# Altium project MSE-Avionic-N1.PrjPcb (part 2 of 2)

## Sheet GPIOSheet.SchDoc
size A; SheetNumber: 4; SheetTotal: 4
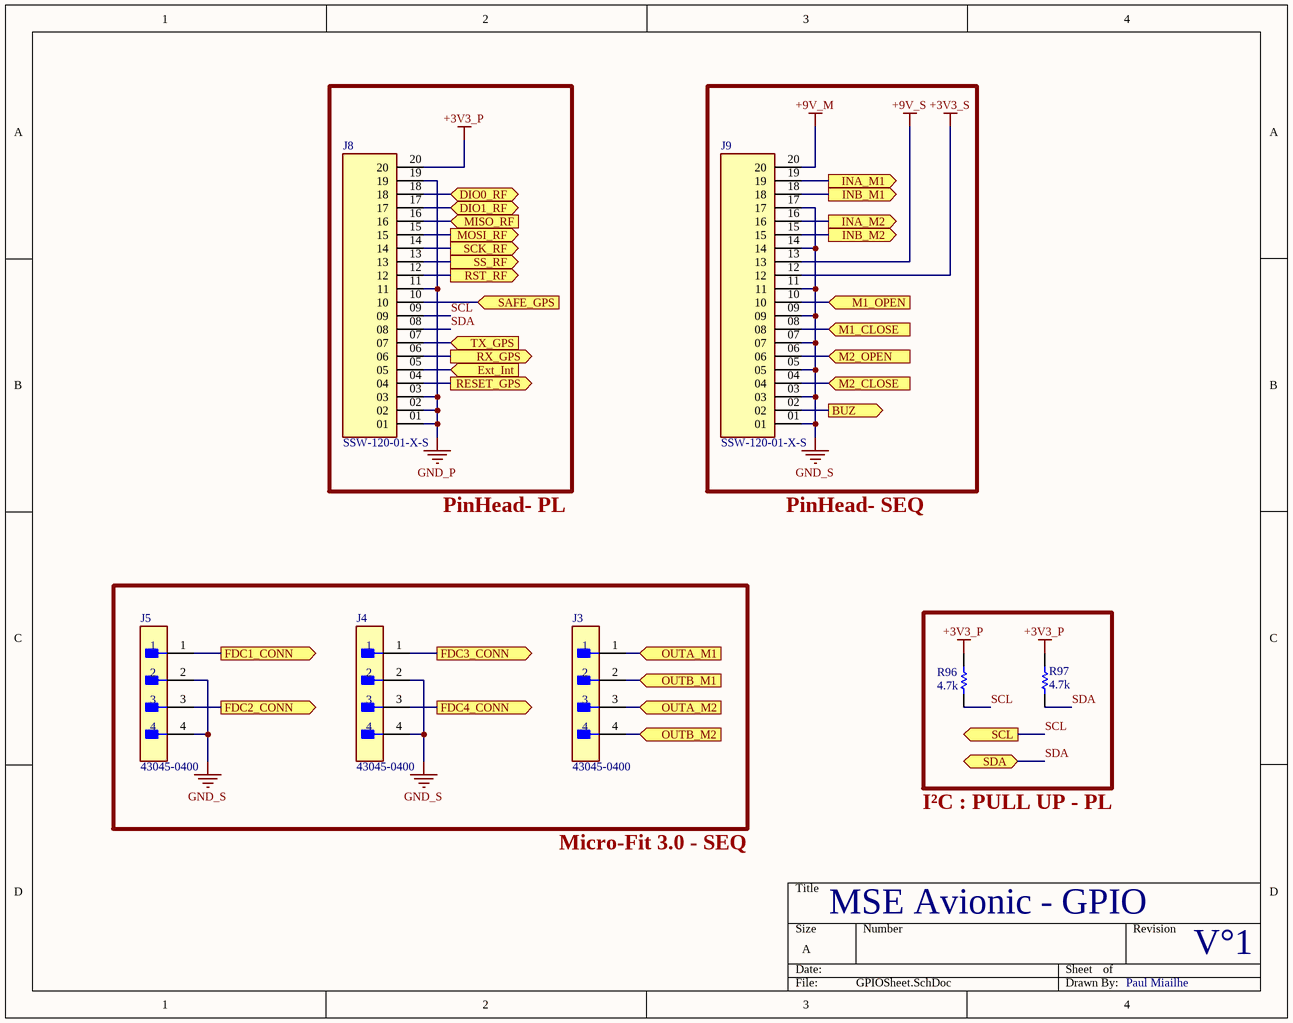
[diagram p3: GPIOSheet.SchDoc]

### Parts
J3  43045-0400  [FP-43045-0400-MFG]
J4  43045-0400  [FP-43045-0400-MFG]
J5  43045-0400  [FP-43045-0400-MFG]
J8  SSW-120-01-X-S  [SAMTEC_SSW-120-01-X-S]
J9  SSW-120-01-X-S  [SAMTEC_SSW-120-01-X-S]
R96  Resistance: 4.7k  [RESC1608X55X25LL10T15]  (hidden comment: RC0603FR-074K7L)
R97  Resistance: 4.7k  [RESC1608X55X25LL10T15]  (hidden comment: RC0603FR-074K7L)

### Ports
BUZ (out), DIO0_RF (bidir), DIO1_RF (bidir), Ext_Int (in), FDC1_CONN (out), FDC2_CONN (out), FDC3_CONN (out), FDC4_CONN (out), INA_M1 (out), INA_M2 (out), INB_M1 (out), INB_M2 (out), M1_CLOSE (in), M1_OPEN (in), M2_CLOSE (in), M2_OPEN (in), MISO_RF (in), MOSI_RF (out), OUTA_M1 (in), OUTA_M2 (in), OUTB_M1 (in), OUTB_M2 (in), RESET_GPS (out), RST_RF (out), RX_GPS (out), SAFE_GPS (in), SCK_RF (out), SCL (out), SDA (bidir), SS_RF (out), TX_GPS (in)

### Nets
+3V3_P: J8.20 R96.2 R97.2
+3V3_S: J9.12
+9V_M: J9.20
+9V_S: J9.13
GND_P: J8.01 J8.02 J8.03 J8.11 J8.19
GND_S: J4.2 J4.4 J5.2 J5.4 J9.01 J9.03 J9.05 J9.07 J9.09 J9.11 J9.14 J9.17
M1_CLOSE: J9.08 ; port M1_CLOSE
M1_OPEN: J9.10 ; port M1_OPEN
M2_CLOSE: J9.04 ; port M2_CLOSE
M2_OPEN: J9.06 ; port M2_OPEN
OUTA_M1: J3.1 ; port OUTA_M1
OUTA_M2: J3.3 ; port OUTA_M2
OUTB_M1: J3.2 ; port OUTB_M1
OUTB_M2: J3.4 ; port OUTB_M2
SCL: J8.09 R96.1 ; port SCL
SDA: J8.08 R97.1 ; port SDA
NetC7_2: J5.1 ; port FDC1_CONN
NetC8_2: J5.3 ; port FDC2_CONN
NetC9_2: J4.1 ; port FDC3_CONN
NetC10_2: J4.3 ; port FDC4_CONN
NetJ8_04: J8.04 ; port RESET_GPS
NetJ8_05: J8.05 ; port Ext_Int
NetJ8_06: J8.06 ; port RX_GPS
NetJ8_07: J8.07 ; port TX_GPS
NetJ8_10: J8.10 ; port SAFE_GPS
NetJ8_12: J8.12 ; port RST_RF
NetJ8_13: J8.13 ; port SS_RF
NetJ8_14: J8.14 ; port SCK_RF
NetJ8_15: J8.15 ; port MOSI_RF
NetJ8_16: J8.16 ; port MISO_RF
NetJ8_17: J8.17 ; port DIO1_RF
NetJ8_18: J8.18 ; port DIO0_RF
NetJ9_02: J9.02 ; port BUZ
NetJ9_15: J9.15 ; port INB_M2
NetJ9_16: J9.16 ; port INA_M2
NetJ9_18: J9.18 ; port INB_M1
NetJ9_19: J9.19 ; port INA_M1

### Notes on the sheet
- PinHead- PL
- PinHead- SEQ
- Micro-Fit 3.0 - SEQ
- I²C : PULL UP - PL
- MSE Avionic - GPIO
- V°1
- Paul Miailhe

### Library data of the parts
J3-J5 = CMP-04776-000002-1: CONN HEADER R/A 4POS 3MM; Manufacturer: Molex; Conn Gender: Male; Conn Orientation: Right Angle; Voltage Rating: 600V; Number Of Contacts: 4; Is Female: yes; Current Rating: 8.5A; ComponentLink2URL: https://www.molex.com/webdocs/datasheets/pdf/en-us/0430450400_PCB_HEADERS.pdf; Manufacturer Part Number: 43045-0400; Digikey Description: CONN HEADER R/A 4POS 3MM; Category: Conn; Temperature Range High: +105°C; Lead Free: Yes; Device Class L1: Connectors; Automotive: No; Temperature: -40°C to +105°C; Footprint Url: https://www.molex.com/pdm_docs/sd/430450400_sd.pdf; Height: 9.27mm; Number Of Rows: 2; Device Class L3: unset; Pitch: 3mm; Temperature Range Low: -40°C; Contact Material: Tin,Nickel; Octopart: https://octopart.com/43045-0400-molex-287063; RoHS: TRUE; ComponentLink2Description: Datasheet; Package: 43045-0400; Device Class L2: Headers and Wire Housings
J8 J9 = CMP-011-000000-2: SSW - Samtec 2.54mm Single Row Straight Socket Strip 8.5 Profile - Fast Stock; MP: SSW-120-01-G-S; Value: *; Check_prices: https://www.snapeda.com/parts/SSW-120-01-G-S/Samtec/view-part/598388/?ref=eda; Price: None; Design Item ID: SSW-120-01-X-S; SnapEDA_Link: https://www.snapeda.com/parts/SSW-120-01-G-S/Samtec/view-part/598388/?ref=snap; Component Type: Standard; MF: Samtec; Source: SSW-120-01-X-S.SchLib; Package: None; Pin Count: 20; Availability: Bad; Purchase-URL: https://pricing.snapeda.com/search/part/SSW-120-01-G-S/?ref=eda
R96 R97 = CMP-2000-06942-1: Chip Resistor, 4.7 KOhm, +/- 1%, 0.1 W, -55 to 155 degC, 0603 (1608 Metric), RoHS, Tape and Reel; Manufacturer: Yageo; Power Rating: 100mW; Temperature Coefficient: 100PPM/C; Voltage Rating: 50V; Package Reference: 0603; Series: RC; Datasheet Version: Rev. 7, 05/2017; Packaging: Reel; Termination Style: SMD/SMT; Datasheet URL: http://www.yageo.com/documents/recent/PYu-RC_Group_51_RoHS_L_7.pdf; Manufacturer URL: http://www.yageo.com/; Package Description: 2-Pin Surface Mount Device, Body 1.6 x 0.8 mm; Case Code - mm: 1608; Mounting Technology: SurfaceMount; Operating Temperature Range: -55Cto+155C; Tolerance: 1%; Product: ThickFilmResistorsGeneralPurpose; Supplier 1: Mouser; Supplier Part Number 1: 603-RC0603FR-074K7L; Manufacturer Part Number: RC0603FR-074K7L; RoHS: Yes; Category: Chip SMD Resistors; Stock 1: 772810; Pricing 1: 1=0,10000, 10=0,02400, 50=0,02400, 100=0,01000, 1000=0,00400, 5000=0,00300, 10000=0,00300 (USD); Case/Package: 0603; Number of Pins: 2; Case Code (Imperial): 0603; Case Code (Metric): 1608; Size Code: 0603; Min Operating Temperature: -55°C; Max Operating Temperature: 155°C; Voltage Rating (DC): 50V; Termination: SMD/SMT; Resistor Type: Thick Film; Features: Moisture Resistant; Max Power Dissipation: 100mW; Number of Terminations: 2; Construction: Rectangular; Resistance Tolerance: 1%; Length: 1.6mm; Width: 0.8mm; Height: 0.45mm; Depth: 0.8mm; Lead Pitch: 0.3mm; REACH SVHC: No SVHC; Military Standard: Not; Lead Free: Lead Free; RoHS Compliant: Yes; ComponentLink1URL: https://datasheet.ciiva.com/15189/getdatasheetpartid-422754-15189760.pdf?src-supplier=Verical; ComponentLink1Description: https://datasheet.ciiva.com/15189/getdatasheetpartid-422754-15189760.pdf?src-supplier=Verical; ComponentLink2URL: https://datasheet.ciiva.com/22747/443971-22747528.pdf?src-supplier=Element14; ComponentLink2Description: https://datasheet.ciiva.com/22747/443971-22747528.pdf?src-supplier=Element14; ComponentLink3URL: https://datasheet.ciiva.com/7660/38590-7660794.pdf?src-supplier=Element14; ComponentLink3Description: https://datasheet.ciiva.com/7660/38590-7660794.pdf?src-supplier=Element14; ComponentLink4URL: https://datasheet.ciiva.com/7746/1868787-7746365.pdf?src-supplier=Element14; ComponentLink4Description: https://datasheet.ciiva.com/7746/1868787-7746365.pdf?src-supplier=Element14; ComponentLink5URL: https://datasheet.ciiva.com/46440/1868787-46440909.pdf?src-supplier=Element14; ComponentLink5Description: https://datasheet.ciiva.com/46440/1868787-46440909.pdf?src-supplier=Element14; ComponentLink6URL: https://datasheet.ciiva.com/7746/1738695-7746366.pdf?src-supplier=Element14; ComponentLink6Description: https://datasheet.ciiva.com/7746/1738695-7746366.pdf?src-supplier=Element14

## Nets that join several sheets
+3V3_P: SensorSheet (6 pins), GPIOSheet (J8.20 R96.2 R97.2)
+3V3_S: MotorSheet (8 pins), SensorSheet (C14.2 R37.2), GPIOSheet (J9.12)
+9V_M: MotorSheet (6 pins), GPIOSheet (J9.20)
+9V_S: SensorSheet (C15.1 R40.2), GPIOSheet (J9.13)
GND_P: SensorSheet (24 pins), GPIOSheet (5 pins)
GND_S: MotorSheet (26 pins), SensorSheet (5 pins), GPIOSheet (12 pins)
M1_CLOSE: MotorSheet (R24.2 R30.1), GPIOSheet (J9.08)
M1_OPEN: MotorSheet (R23.2 R29.1), GPIOSheet (J9.10)
M2_CLOSE: MotorSheet (R26.2 R32.1), GPIOSheet (J9.04)
M2_OPEN: MotorSheet (R25.2 R31.1), GPIOSheet (J9.06)
NetC7_2: MotorSheet (C7.2 R11.1 R17.2), GPIOSheet (J5.1)
NetC8_2: MotorSheet (C8.2 R12.1 R18.2), GPIOSheet (J5.3)
NetC9_2: MotorSheet (C9.2 R13.1 R19.2), GPIOSheet (J4.1)
NetC10_2: MotorSheet (C10.2 R14.1 R20.2), GPIOSheet (J4.3)
NetJ8_04: SensorSheet (R67.1), GPIOSheet (J8.04)
NetJ8_05: SensorSheet (R73.2), GPIOSheet (J8.05)
NetJ8_06: SensorSheet (R71.2), GPIOSheet (J8.06)
NetJ8_07: SensorSheet (R72.2), GPIOSheet (J8.07)
NetJ8_10: SensorSheet (R66.1), GPIOSheet (J8.10)
NetJ8_12: SensorSheet (R44.1), GPIOSheet (J8.12)
NetJ8_13: SensorSheet (R48.1), GPIOSheet (J8.13)
NetJ8_14: SensorSheet (R45.1), GPIOSheet (J8.14)
NetJ8_15: SensorSheet (R46.1), GPIOSheet (J8.15)
NetJ8_16: SensorSheet (R47.1), GPIOSheet (J8.16)
NetJ8_17: SensorSheet (R52.2), GPIOSheet (J8.17)
NetJ8_18: SensorSheet (R51.2), GPIOSheet (J8.18)
NetJ9_02: SensorSheet (R35.1 R36.1), GPIOSheet (J9.02)
NetJ9_15: MotorSheet (R8.1), GPIOSheet (J9.15)
NetJ9_16: MotorSheet (R7.1), GPIOSheet (J9.16)
NetJ9_18: MotorSheet (R4.1), GPIOSheet (J9.18)
NetJ9_19: MotorSheet (R3.1), GPIOSheet (J9.19)
OUTA_M1: MotorSheet (DS1.1 DS2.2 R58.2), GPIOSheet (J3.1)
OUTA_M2: MotorSheet (DS3.1 DS4.2 R60.2), GPIOSheet (J3.3)
OUTB_M1: MotorSheet (R9.1 R59.2), GPIOSheet (J3.2)
OUTB_M2: MotorSheet (R10.1 R61.2), GPIOSheet (J3.4)
SCL: SensorSheet (R69.2), GPIOSheet (J8.09 R96.1)
SDA: SensorSheet (R70.2), GPIOSheet (J8.08 R97.1)